# EasyEDA Pro project busmaster-v101.eprj, board base-board
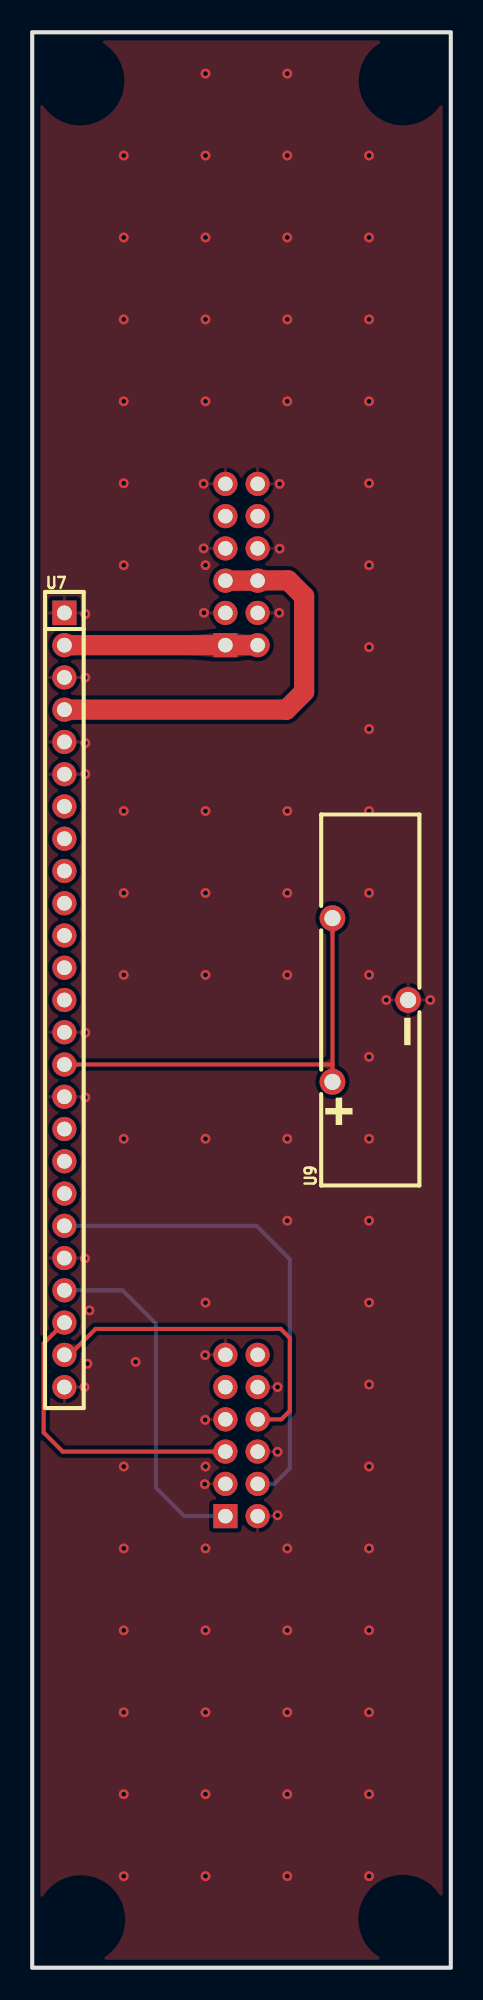
[diagram p4: board, top side]
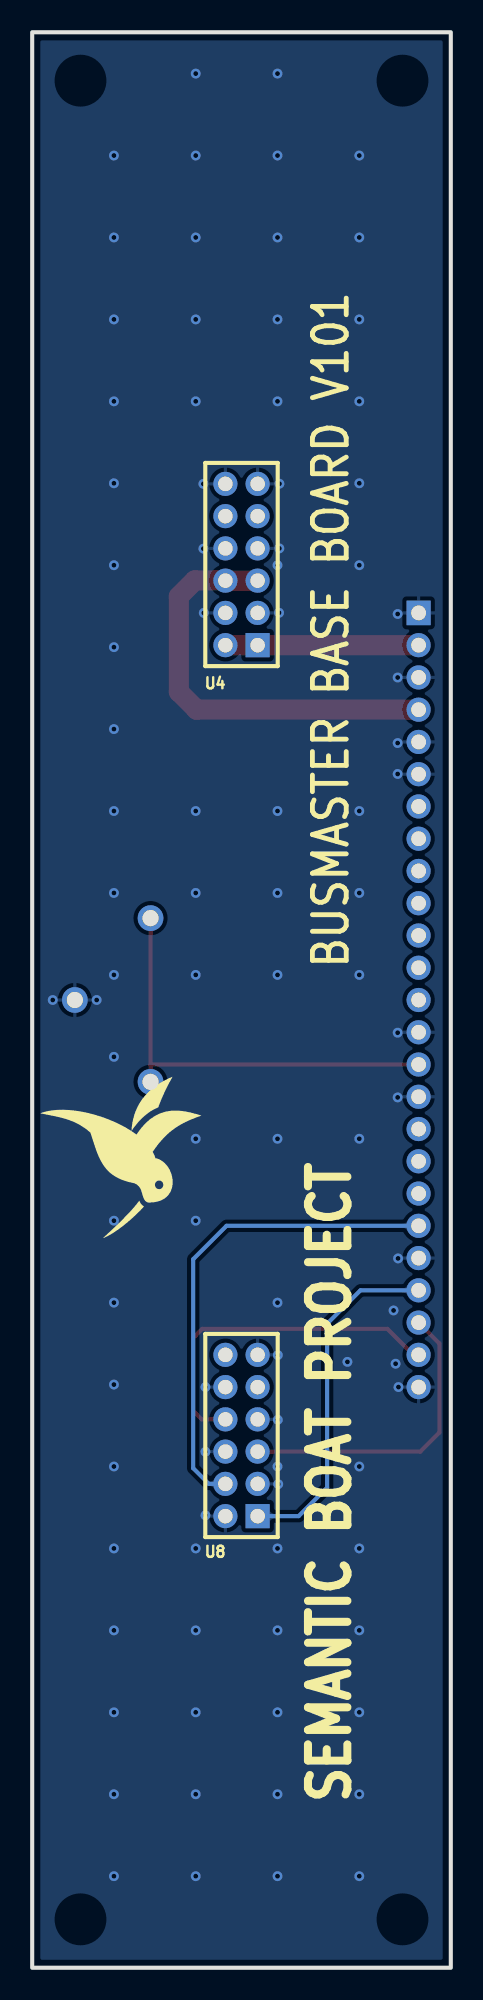
[diagram p5: board, bottom side, seen from below]

Outline 26 x 120 mm; copper layers: Top Layer, Bottom Layer. Coordinates in mm from the lower left corner of the outline.
Outline path: rectangle 0,120 26,0
Stack: Top Layer 0.035mm / Dielectric1 1.51mm FR4 er 4.5 / Bottom Layer 0.035mm

## Design rules (mm)
template: JLCPCB Capability(Two Layers Board)
spacing copperThickness1oz (default): track to track 0.102, other pairs 0.152 to 0.3
spacing copperThickness2oz: track to track 0.203, other pairs 0.152 to 0.3
track width copperThickness1oz (default): min 0.127, default 0.254, max 2.54
track width copperThickness2oz: min 0.203, default 0.254, max 2.54
differential pair differentialPair (default): width min 0.127, default 0.254, max 2.54; gap min 0.152, default 0.152
via viaSize (default): diameter min 0.5, default 0.61, max 10; hole min 0.3, default 0.305, max 6.3

## Placement (name value [footprint] x y rotation side)
U4  2005FV-2x6P  [HDR-TH_12P-P2.00-V-F-R2-C6-S2.00]  13 87 90 bottom
U7  DW200R-11-25-43  [HDR-TH_25P-P2.00-V-F-1]  2 60 270 top
U8  2005FV-2x6P  [HDR-TH_12P-P2.00-V-F-R2-C6-S2.00]  13 33 90 bottom
U9  VBH2032-1  [BAT-TH_3P-L23.0-W6.0_VBH2032-1]  21 60 90 top

## Footprints (pads in the part's own frame, mm; a bottom-side part is the same pattern mirrored in y, then rotated)
BAT-TH_3P-L23.0-W6.0_VBH2032-1
  round 1.6 hole 1: 1(-5.075,2.35) 2(5.075,2.35) 3(0,-2.35)
HDR-TH_12P-P2.00-V-F-R2-C6-S2.00
  rect 1.5x1.5 hole 0.9: 1(-5,-1)
  round 1.5 hole 0.9: 2(-5,1) 3(-3,-1) 4(-3,1) 5(-1,-1) 6(-1,1) 7(1,-1) 8(1,1) 9(3,-1) 10(3,1) 11(5,-1) 12(5,1)
HDR-TH_25P-P2.00-V-F-1
  rect 1.524x1.5 hole 0.914: 1(-24,0)
  round 1.5 hole 0.914: 2(-22,0) 3(-20,0) 4(-18,0) 5(-16,0) 6(-14,0) 7(-12,0) 8(-10,0) 9(-8,0) 10(-6,0) 11(-4,0) 12(-2,0) 13(0,0) 14(2,0) 15(4,0) 16(6,0) 17(8,0) 18(10,0) 19(12,0) 20(14,0) 21(16,0) 22(18,0) 23(20,0) 24(22,0) 25(24,0)

## Nets
As in the schematic.

Pads without a net: U4 9 10; U7 7 8 9 10 11 12 13 17 18 19; U8 9 12

## Via types
v1: diameter 0.61, hole 0.305, Top Layer to Bottom Layer, 95 vias

## Routing (per net, layer and track width the routed paths; a pad name or vN(x,y) marks a point on that pad's centre or on a via; arc(x,y) is an arc through that point)
+5V: length 26.6
  Top Layer w1.25: U4.5 U4.6 14.01,86.02 15.9,86.02 16.89,85.02 16.89,79.11 15.78,78 U7.4
+12V: length 12
  Top Layer w1.25: U7.2 U4.1 U4.2
GND:
  vias: v1(3.3,83.93) v1(3.3,80) v1(3.3,75.93) v1(3.3,74.01) v1(3.3,57.97) v1(3.3,53.96) v1(3.28,43.98) v1(3.25,36) v1(3.43,37.45) v1(3.56,40.75) v1(5.68,112.36) v1(5.68,107.28) v1(5.68,102.2) v1(5.68,97.12) v1(5.68,92.04) v1(5.68,86.96) v1(5.68,71.72) v1(5.68,66.64) v1(5.68,61.56) v1(5.68,51.4) v1(5.68,31.08) v1(5.68,26) v1(5.68,20.92) v1(5.68,15.84) v1(5.68,10.76) v1(5.68,5.68) v1(6.42,37.56) v1(10.64,92.01) v1(10.65,88) v1(10.67,84.01) v1(10.74,37.98) v1(10.74,33.97) v1(10.72,29.98) v1(10.76,117.44) v1(10.76,112.36) v1(10.76,107.28) v1(10.76,102.2) v1(10.76,97.12) v1(10.76,86.96) v1(10.76,71.72) v1(10.76,66.64) v1(10.76,61.56) v1(10.76,51.4) v1(10.76,41.24) v1(10.76,31.08) v1(10.76,26) v1(10.76,20.92) v1(10.76,15.84) v1(10.76,10.76) v1(10.76,5.68) v1(15.24,36) v1(15.24,31.99) v1(15.24,28.05) v1(15.34,84) v1(15.37,92) v1(15.37,87.98) v1(15.84,117.44) v1(15.84,112.36) v1(15.84,107.28) v1(15.84,102.2) v1(15.84,97.12) v1(15.84,71.72) v1(15.84,66.64) v1(15.84,61.56) v1(15.84,51.4) v1(15.84,46.32) v1(15.84,26) v1(15.84,20.92) v1(15.84,15.84) v1(15.84,10.76) v1(15.84,5.68) v1(20.92,112.36) v1(20.92,107.28) v1(20.92,102.2) v1(20.92,97.12) v1(20.92,92.04) v1(20.92,86.96) v1(20.92,81.88) v1(20.92,76.8) v1(20.92,71.72) v1(20.92,66.64) v1(20.92,61.56) v1(20.92,56.48) v1(20.92,51.4) v1(20.92,46.32) v1(20.92,41.24) v1(20.92,36.16) v1(20.92,31.08) v1(20.92,26) v1(20.92,20.92) v1(20.92,15.84) v1(20.92,10.76) v1(20.92,5.68) v1(22,60) v1(24.72,60)
VBAT: length 26.8
  Top Layer w0.254: U9.1 18.65,56 ; 18.65,56 U9.2 ; 18.65,56 U7.15
SMB_ALERT: length 21.6
  Top Layer w0.254: U8.8 15.47,34 16,34.53 16,39.04 15.44,39.61 3.94,39.61 2.33,38 U7.24
SMB_CLK: length 21.8
  Bottom Layer w0.254: U8.1 9.45,28 7.68,29.77 7.68,39.93 5.61,42 U7.22
SMB_DATA: length 19.1
  Top Layer w0.254: U7.23 0.71,38.71 0.71,33.18 1.89,32 U8.5
STACK_ENABLE: length 30.2
  Bottom Layer w0.254: U8.4 15.03,30 16,30.97 16,43.93 13.93,46 U7.20

## Copper pours and planes (outline as drawn; the poured copper is in the pictures)
GND on Top Layer: 0.18,119.75 25.88,119.75 25.88,0.11 0.18,0.11
GND on Bottom Layer: -3.56,123.05 29.72,123.05 29.72,-3.82 -3.56,-3.82

Small or netless copper shapes (teardrops, artwork), in the pictures only: 15 on Top Layer, 4 on Bottom Layer

## Text on the board
Bottom Silkscreen Layer: BUSMASTER BASE BOARD V101 | SEMANTIC BOAT PROJECT
